# Altium schematic sheet Power.SchDoc
size A4; DrawnBy: Emile Renaud; Revision: V1.0; SheetNumber: 3; SheetTotal: 5
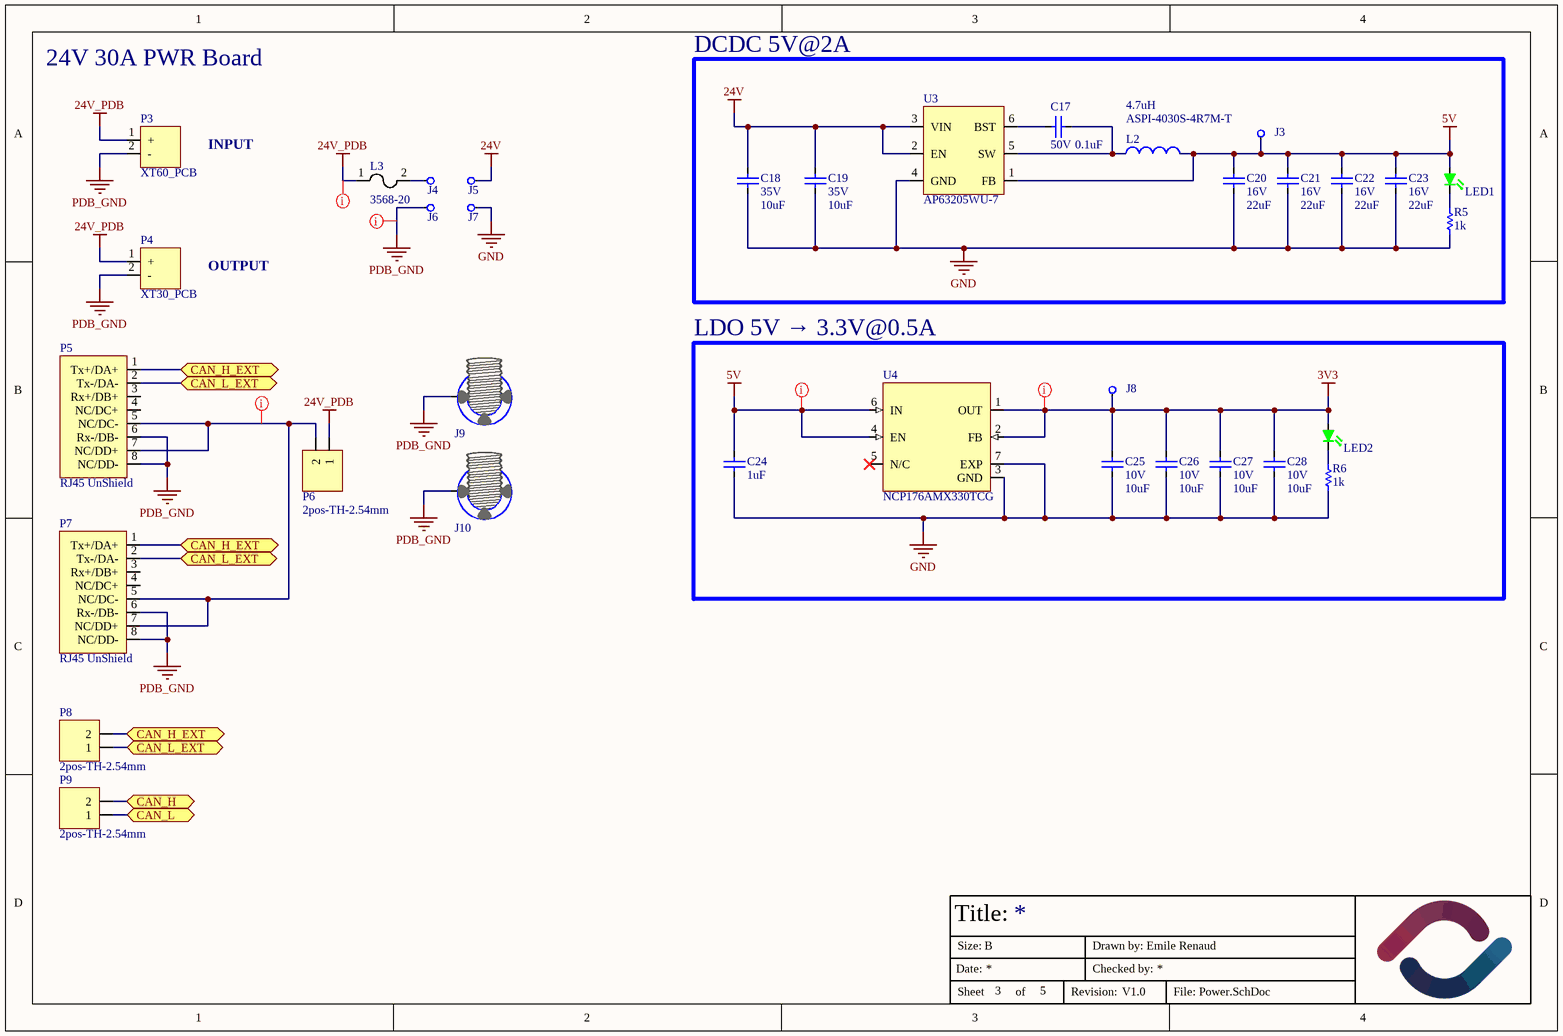
[diagram p0: Power.SchDoc]

## Parts
C17  value 0.1uF  Volt: 50V  [CAPACITOR-0603]  (hidden comment: Capacitor-0603-0.1uF-50V-X7R)
C18  value 10uF  Volt: 35V  [CAPACITOR-0805]  (hidden comment: Capacitor-0805-10uF-35V-X5R)
C19  value 10uF  Volt: 35V  [CAPACITOR-0805]  (hidden comment: Capacitor-0805-10uF-35V-X5R)
C20  value 22uF  Volt: 16V  [CAPACITOR-0805]  (hidden comment: Capacitor-0805-22uF-16V-X5R)
C21  value 22uF  Volt: 16V  [CAPACITOR-0805]  (hidden comment: Capacitor-0805-22uF-16V-X5R)
C22  value 22uF  Volt: 16V  [CAPACITOR-0805]  (hidden comment: Capacitor-0805-22uF-16V-X5R)
C23  value 22uF  Volt: 16V  [CAPACITOR-0805]  (hidden comment: Capacitor-0805-22uF-16V-X5R)
C24  value 1uF  [CAPACITOR-0603]  (hidden comment: Capacitor-0603-1uF-25V-X5R)
C25  value 10uF  Volt: 10V  [CAPACITOR-0603]  (hidden comment: Capacitor-0603-10uF-10V-X5R)
C26  value 10uF  Volt: 10V  [CAPACITOR-0603]  (hidden comment: Capacitor-0603-10uF-10V-X5R)
C27  value 10uF  Volt: 10V  [CAPACITOR-0603]  (hidden comment: Capacitor-0603-10uF-10V-X5R)
C28  value 10uF  Volt: 10V  [CAPACITOR-0603]  (hidden comment: Capacitor-0603-10uF-10V-X5R)
J3  hole  [PAD-1.2MM-silk]  (value not drawn)  (no BOM)
J4  hole  [HOLE-2.70MM]  (value not drawn)  (no BOM)
J5  hole  [HOLE-2.70MM]  (value not drawn)  (no BOM)
J6  hole  [HOLE-2.70MM]  (value not drawn)  (no BOM)
J7  hole  [HOLE-2.70MM]  (value not drawn)  (no BOM)
J8  hole  [PAD-1.2MM-silk]  (value not drawn)  (no BOM)
J9  hole  [HOLE-3.40MM-M3-7MMEYELET-MountingFeature]  (value not drawn)  (no BOM)
J10  hole  [HOLE-3.40MM-M3-7MMEYELET-MountingFeature]  (value not drawn)  (no BOM)
L2  ASPI-4030S-4R7M-T  value 4.7uH  [INDUCTOR_ASPI-4030S-100M]
L3  3568-20  [FUSE_3568-20]
LED1  3147-B1911NG--20D000214U1930CT-ND  [LED-0603-2PIN-SILKSCREEN]  (value not drawn)
LED2  3147-B1911NG--20D000214U1930CT-ND  [LED-0603-2PIN-SILKSCREEN]  (value not drawn)
P3  XT60_PCB  [XT60PW-M]
P4  XT30_PCB  [XT30PW_smd]
P5  RJ45 UnShield  [AMPHENOL_54602-908LF]
P6  2pos-TH-2.54mm  [HDR1X2]
P7  RJ45 UnShield  [AMPHENOL_54602-908LF]
P8  2pos-TH-2.54mm  [HDR1X2]
P9  2pos-TH-2.54mm  [HDR1X2]
R5  value 1k  [Resistor-0603]  (hidden comment: SMT resistor)
R6  value 1k  [Resistor-0603]  (hidden comment: SMT resistor)
U3  AP63205WU-7  [SOT-23-6]
U4  NCP176AMX330TCG  [XFDFN-6 Exposed Pad]

## Blocks framed on the sheet
DCDC 5V@2A: C17-C23 J3 L2 LED1 R5 U3
LDO 5V → 3.3V@0.5A: C24-C28 J8 LED2 R6 U4

## Ports
CAN_H (bidir, see ESP32[2C]), CAN_H_EXT (bidir, see Power[1B], Power[1C]), CAN_H_EXT (bidir, see Power[1C]), CAN_L (bidir, see ESP32[2D]), CAN_L_EXT (bidir, see Power[1B], Power[1C]), CAN_L_EXT (bidir, see Power[1C])

## Nets
3V3: C25.2 C26.2 C27.2 C28.2 J8.1 LED2.2(R) U4.1(OUT) U4.2(FB)
5V: C20.2 C21.2 C22.2 C23.2 C24.2 J3.1 L2.2 LED1.2(R) U3.1(FB) U4.4(EN) U4.6(IN)
24V: C18.2 C19.2 J5.1 U3.2(EN) U3.3(VIN)
24V_PDB: L3.1 P3.1(+) P4.1(+) P6.1
GND: C18.1 C19.1 C20.1 C21.1 C22.1 C23.1 C24.1 C25.1 C26.1 C27.1 C28.1 J7.1 R5.1 R6.1 U3.4(GND) U4.3(GND) U4.7(EXP)
PDB_GND: J6.1 J9.1 J10.1 P3.2(-) P4.2(-) P5.6(Rx-/DB-) P5.8(NC/DD-) P7.6(Rx-/DB-) P7.8(NC/DD-)
CAN_H: P9.2 ; port CAN_H
CAN_H_EXT: P5.1(Tx+/DA+) P7.1(Tx+/DA+) P8.2 ; port CAN_H_EXT
CAN_L: P9.1 ; port CAN_L
CAN_L_EXT: P5.2(Tx-/DA-) P7.2(Tx-/DA-) P8.1 ; port CAN_L_EXT
NetC17_1: C17.1 U3.6(BST)
NetC17_2: C17.2 L2.1 U3.5(SW)
NetJ4_1: J4.1 L3.2
NetLED1_1: LED1.1(K) R5.2
NetLED2_1: LED2.1(K) R6.2
NetP5_5: P5.5(NC/DC-) P5.7(NC/DD+) P6.2 P7.5(NC/DC-) P7.7(NC/DD+)

Not connected (* = marked no-connect by the designer): P5 3(Rx+/DB+) 4(NC/DC+); P7 3(Rx+/DB+) 4(NC/DC+); U4 5(N/C)*

## Layout directives
net class LOW_POWER: 3V3, 5V
net class Power: 24V_PDB, NetP5_5, PDB_GND

## Notes on the sheet
- 24V 30A PWR Board
- INPUT
- OUTPUT
- Title:
- Date:
- Size:
- B
- Drawn by:
- Checked by:
- Sheet
- of
- Revision:
- File:

## Library data of the parts
C17 = Capacitor-0603-0.1uF-50V-X7R: Precision: X7R-10%; Package / Case: Metric 1608, EIA 0603; Mounted: Yes; Supplier 1: Digi-Key; Supplier Part Number 1: 1276-1935-2-ND; Supplier 2: Digi-Key; Supplier Part Number 2: 1276-1934-2-ND
C18 C19 = Capacitor-0805-10uF-35V-X5R: Precision: X5R-10%; Package / Case: Metric 2012 , EIA 0805; Mounted: Yes; Supplier 1: Digi-Key; Supplier Part Number 1: 490-10515-1-ND; Supplier 2: Digi-Key
C20-C23 = Capacitor-0805-22uF-16V-X5R: Precision: X5R-10%; Package / Case: Metric 2012 , EIA 0805; Mounted: Yes; Supplier 1: Digi-Key; Supplier Part Number 1: 1276-6780-1-ND; Supplier 2: Digi-Key
C24 = Capacitor-0603-1uF-25V-X5R: Precision: X5R-10%; Volt: 25V; Package / Case: Metric 1608, EIA 0603; Mounted: Yes; Supplier 1: Digi-Key; Supplier Part Number 1: 1276-1859-2-ND; Supplier 2: Digi-Key; Supplier Part Number 2: 1276-1942-2-ND
C25-C28 = Capacitor-0603-10uF-10V-X5R: 10 µF ±20% 10V Ceramic Capacitor X5R 0603 (1608 Metric); Supplier 1: Digikey; Supplier Part Number 1: 4713-GMC10X5R106M10NTCT-ND; Mounted: Yes; Package / Case: Metric 1608 , EIA 0603; Precision: 20%
J3 J8 = PAD 1.2mm: Mounted: N/A
J4-J7 = Hole 2.70mm AWG12-Stranded: Hole for 12 AWG Stranded Wire; Mounted: N/A
J9 J10 = Hole 3.40mm M3-MountingFeature: Hole for M3 Bolt with 7mm pad; Mounted: N/A
L2 = ASPI-4030S-4R7M-T: 4.7 µH Shielded Drum Core, Wirewound Inductor 2 A 60mOhm Nonstandard; Current: 2A; Precision: 20%; Supplier 1: Digi-Key; Mounted: Yes; Supplier Part Number 1: 535-12322-1-ND; Package / Case: SMD; HelpURL: https://abracon.com/Magnetics/power/ASPI-4030S.pdf
L3 = 3568-20: Fuse Holder 30 A 500V 1 Circuit Blade Through Hole; Current: 30A; Supplier 1: Digi-Key; Mounted: Yes; Supplier Part Number 1: 36-3568-20-ND; Package / Case: TH
LED1 LED2 = LED_GREEN: LED GREEN DIFFUSED 0603 SMD; Package / Case: 0603 (1608 Metric); Mounted: Yes; Supplier 1: Digi-Key; Supplier Part Number 1: 3147-B1911NG--20D000214U1930CT-ND
P3 = XT60_pcb: XT60; Supplier 1: Digi-Key; Supplier Part Number 1: N/A277-1667-ND; Mounted: Yes; Package / Case: TH; Volt: N/A
P4 = XT30_pcb: XT30; Supplier 1: Digi-Key; Mounted: Yes; Package / Case: TH; Volt: N/A
P5 P7 = RJ545: Jack Modular Connector 8p8c (RJ45, Ethernet) 90° Angle (Right) Unshielded Cat3; Supplier 1: Digikey; Supplier Part Number 1: 609-1046-ND; Mounted: Yes; Package / Case: SMD; Volt: N/A; HelpURL: https://cdn.amphenol-cs.com/media/wysiwyg/files/drawing/c-bmj-0102.pdf
P6 P8 P9 = 2pos-TH-2.54mm: 2pos TH 2.54mm Header; Supplier 1: Digi-Key; Supplier Part Number 1: N/A; Mounted: Yes; Package / Case: TH; Volt: N/A
R5 R6 = Resistor0603-1k: Precision: 1%; Watt: 0.1W; Mounted: Yes; Package / Case: Metric 1608, EIA 0603; Supplier 2: Digi-Key; Supplier 4: Digi-Key; Supplier Part Number 2: 311-1.00KHRTR-ND; Supplier 1: Digi-Key; Supplier 3: Digi-Key; Supplier Part Number 1: RMCF0603FT1K00TR-ND; Supplier Part Number 3: AG1307TR-ND
U3 = AP63205WU-7: Fixed 5V@2A. 32V Input. SOT-23-6; Grade: None; Input Max Voltage: 36V; Supplier 1: Digi-Key; Supplier Part Number 1: AP63205WU-7DICT-ND; HelpURL: https://www.diodes.com/assets/Datasheets/AP63200-AP63201-AP63203-AP63205.pdf; Package / Case: SOT-23-6; Mounted: Yes
U4 = NCP176AMX330TCG: IC REG LINEAR 3.3V 500mA 6-XDFN; Supplier 1: Digi-Key; Supplier Part Number 1: NCP176AMX330TCGOSCT-ND; Package / Case: 6-XDFN; Mounted: Yes; HelpURL: https://www.onsemi.com/pdf/datasheet/ncp176-d.pdf